# Altium schematic sheet CM-K230.schdoc
size 132 x 132 mm
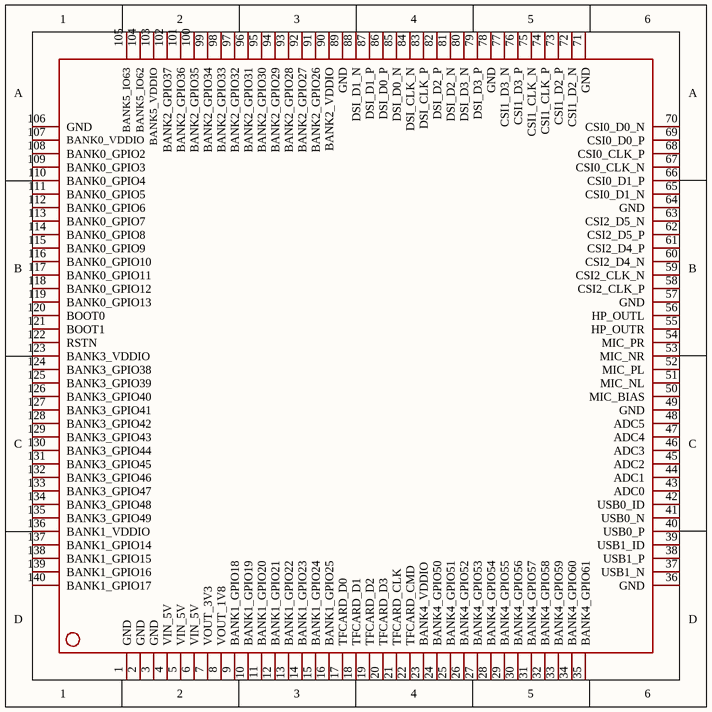
[diagram p0: CM-K230.schdoc]

## Parts
U?  (no value)  [CM-3]

## Nets

Not connected (* = marked no-connect by the designer): U? 1(GND) 2(GND) 3(GND) 4(VIN_5V) 5(VIN_5V) 6(VIN_5V) 7(VOUT_3V3) 8(VOUT_1V8) 9(BANK1_GPIO18) 10(BANK1_GPIO19) 11(BANK1_GPIO20) 12(BANK1_GPIO21) 13(BANK1_GPIO22) 14(BANK1_GPIO23) 15(BANK1_GPIO24) 16(BANK1_GPIO25) 17(TFCARD_D0) 18(TFCARD_D1) 19(TFCARD_D2) 20(TFCARD_D3) 21(TFCARD_CLK) 22(TFCARD_CMD) 23(BANK4_VDDIO) 24(BANK4_GPIO50) 25(BANK4_GPIO51) 26(BANK4_GPIO52) 27(BANK4_GPIO53) 28(BANK4_GPIO54) 29(BANK4_GPIO55) 30(BANK4_GPIO56) 31(BANK4_GPIO57) 32(BANK4_GPIO58) 33(BANK4_GPIO59) 34(BANK4_GPIO60) 35(BANK4_GPIO61) 36(GND) 37(USB1_N) 38(USB1_P) 39(USB1_ID) 40(USB0_P) 41(USB0_N) 42(USB0_ID) 43(ADC0) 44(ADC1) 45(ADC2) 46(ADC3) 47(ADC4) 48(ADC5) 49(GND) 50(MIC_BIAS) 51(MIC_NL) 52(MIC_PL) 53(MIC_NR) 54(MIC_PR) 55(HP_OUTR) 56(HP_OUTL) 57(GND) 58(CSI2_CLK_P) 59(CSI2_CLK_N) 60(CSI2_D4_N) 61(CSI2_D4_P) 62(CSI2_D5_P) 63(CSI2_D5_N) 64(GND) 65(CSI0_D1_N) 66(CSI0_D1_P) 67(CSI0_CLK_N) 68(CSI0_CLK_P) 69(CSI0_D0_P) 70(CSI0_D0_N) 71(GND) 72(CSI1_D2_N) 73(CSI1_D2_P) 74(CSI1_CLK_P) 75(CSI1_CLK_N) 76(CSI1_D3_P) 77(CSI1_D3_N) 78(GND) 79(DSI_D3_P) 80(DSI_D3_N) 81(DSI_D2_N) 82(DSI_D2_P) 83(DSI_CLK_P) 84(DSI_CLK_N) 85(DSI_D0_N) 86(DSI_D0_P) 87(DSI_D1_P) 88(DSI_D1_N) 89(GND) 90(BANK2_VDDIO) 91(BANK2_GPIO26) 92(BANK2_GPIO27) 93(BANK2_GPIO28) 94(BANK2_GPIO29) 95(BANK2_GPIO30) 96(BANK2_GPIO31) 97(BANK2_GPIO32) 98(BANK2_GPIO33) 99(BANK2_GPIO34) 100(BANK2_GPIO35) 101(BANK2_GPIO36) 102(BANK2_GPIO37) 103(BANK5_VDDIO) 104(BANK5_IO62) 105(BANK5_IO63) 106(GND) 107(BANK0_VDDIO) 108(BANK0_GPIO2) 109(BANK0_GPIO3) 110(BANK0_GPIO4) 111(BANK0_GPIO5) 112(BANK0_GPIO6) 113(BANK0_GPIO7) 114(BANK0_GPIO8) 115(BANK0_GPIO9) 116(BANK0_GPIO10) 117(BANK0_GPIO11) 118(BANK0_GPIO12) 119(BANK0_GPIO13) 120(BOOT0) 121(BOOT1) 122(RSTN) 123(BANK3_VDDIO) 124(BANK3_GPIO38) 125(BANK3_GPIO39) 126(BANK3_GPIO40) 127(BANK3_GPIO41) 128(BANK3_GPIO42) 129(BANK3_GPIO43) 130(BANK3_GPIO44) 131(BANK3_GPIO45) 132(BANK3_GPIO46) 133(BANK3_GPIO47) 134(BANK3_GPIO48) 135(BANK3_GPIO49) 136(BANK1_VDDIO) 137(BANK1_GPIO14) 138(BANK1_GPIO15) 139(BANK1_GPIO16) 140(BANK1_GPIO17)

## Library data of the parts
U? = CM-3: Add into BOM: yes; Symbol: CM-3; Device: CM-3; Convert to PCB: yes